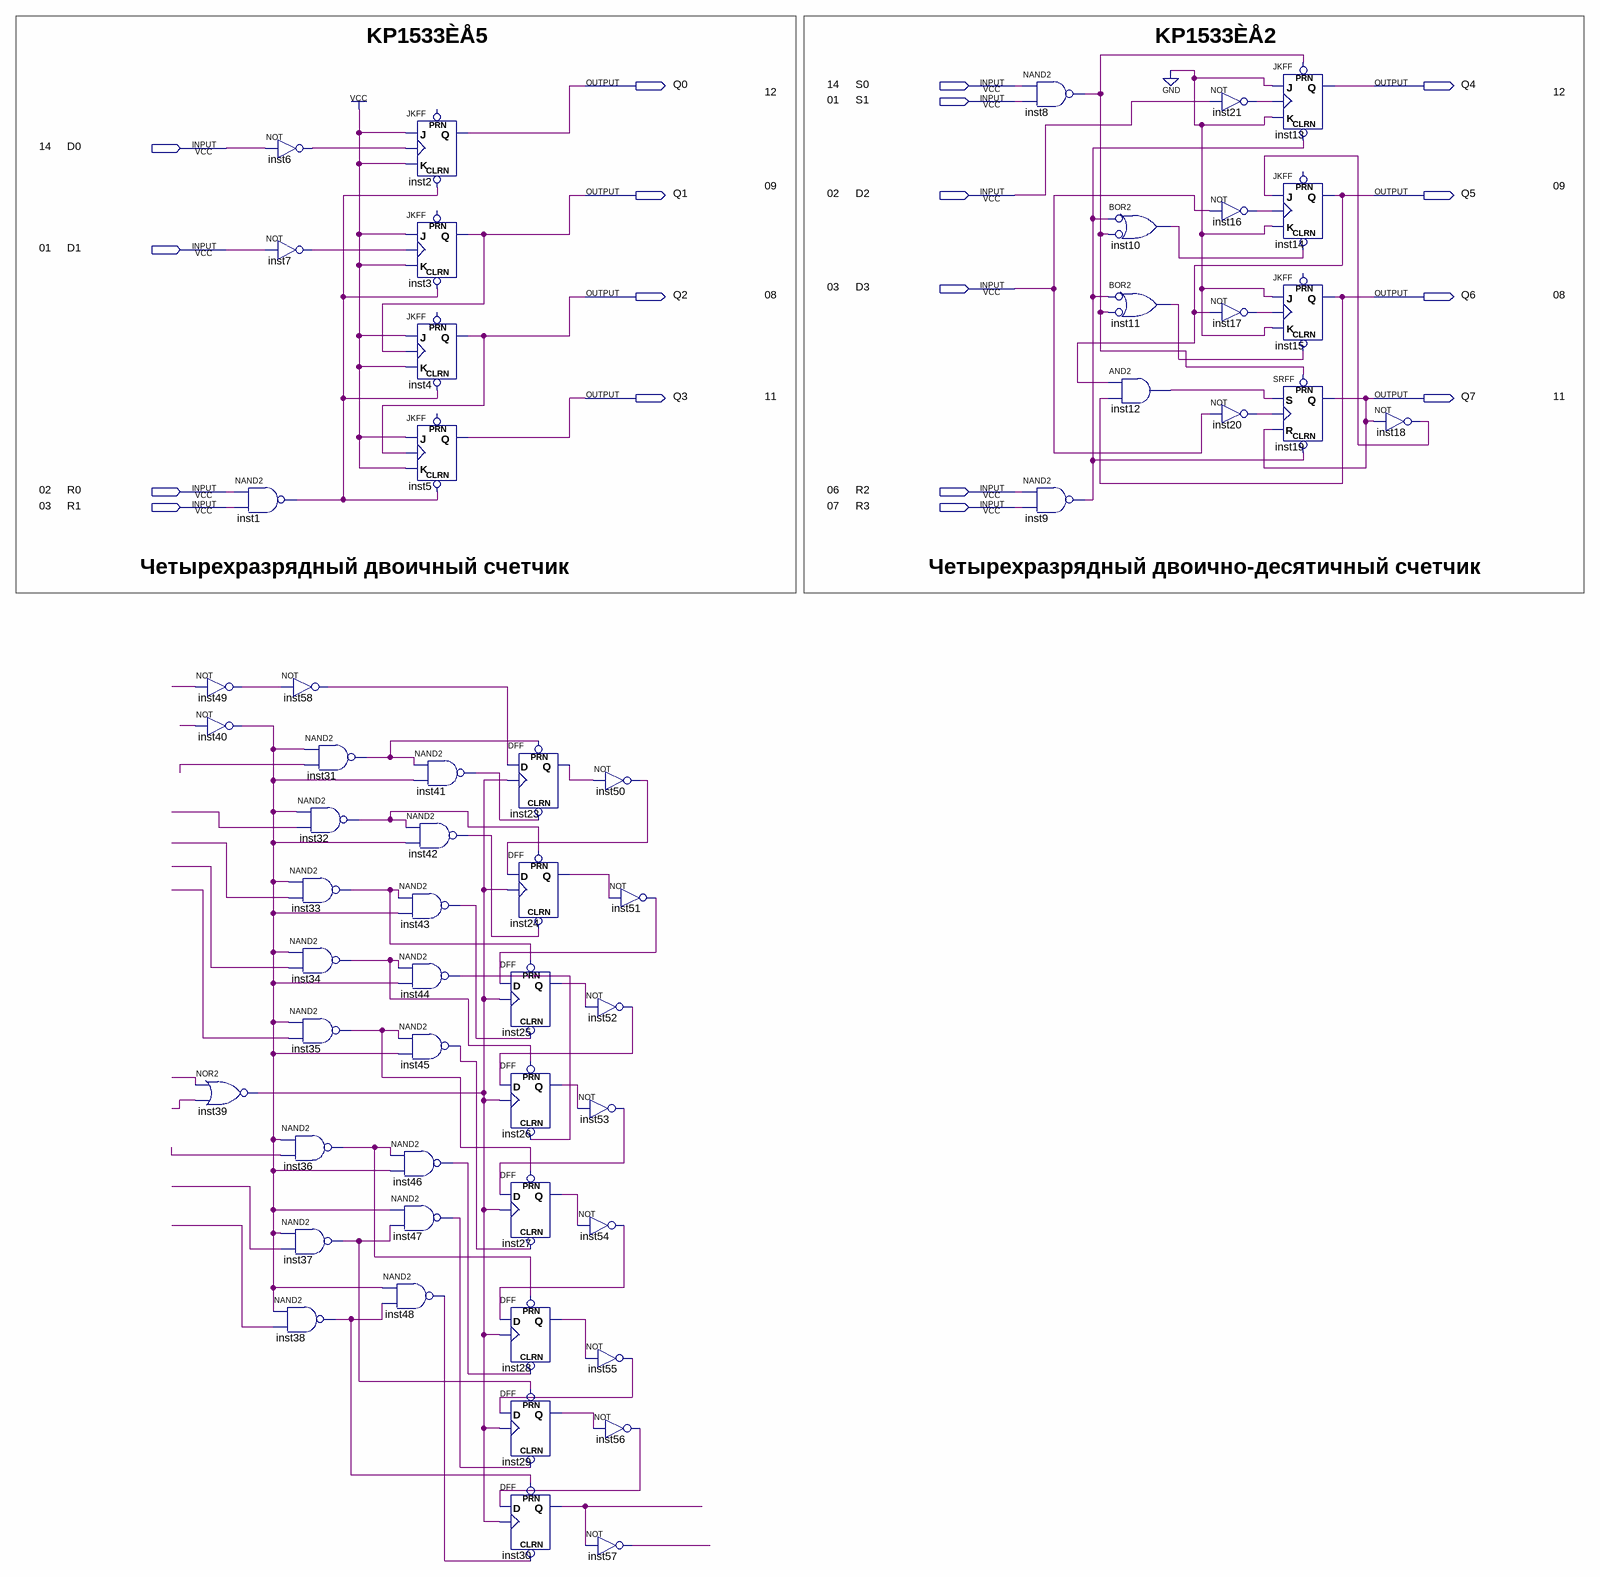
[diagram p0: schematic sheet]
// Quartus schematic tmp.bdf as structural Verilog: 57 symbols, 18 pins
module tmp (
  input  S0,
  input  S1,
  input  D0,
  input  D2,
  input  D1,
  input  D3,
  input  R0,
  input  R2,
  input  R1,
  input  R3,
  output Q0,
  output Q4,
  output Q1,
  output Q5,
  output Q2,
  output Q6,
  output Q3,
  output Q7
);

  wire inst1_out, inst6_out, inst7_out, inst8_out, inst9_out, inst10_out, inst11_out, inst12_out, inst16_out,
       inst17_out, inst18_out, inst20_out, inst21_out, inst23_q, inst24_q, inst25_q, inst26_q, inst27_q,
       inst28_q, inst29_q, inst30_q, inst31_out, inst32_out, inst33_out, inst34_out, inst35_out, inst36_out,
       inst37_out, inst38_out, inst39_out, inst40_out, inst41_out, inst42_out, inst43_out, inst44_out,
       inst45_out, inst46_out, inst47_out, inst48_out, inst49_out, inst50_out, inst51_out, inst52_out,
       inst53_out, inst54_out, inst55_out, inst56_out, inst57_out, inst58_out, undriven, undriven_2,
       undriven_3, undriven_4, undriven_5, undriven_6, undriven_7, undriven_8, undriven_9, undriven_10,
       undriven_11, undriven_12;

  not inst49 (inst49_out, undriven_12);
  not inst40 (inst40_out, undriven_3);
  nor inst39 (inst39_out, undriven, undriven_2);
  not inst6 (inst6_out, D0);
  not inst7 (inst7_out, D1);
  nand inst1 (inst1_out, R0, R1);
  not inst58 (inst58_out, inst49_out);
  nand inst33 (inst33_out, inst40_out, undriven_6);
  nand inst34 (inst34_out, inst40_out, undriven_7);
  nand inst35 (inst35_out, inst40_out, undriven_8);
  nand inst36 (inst36_out, inst40_out, undriven_9);
  nand inst37 (inst37_out, inst40_out, undriven_10);
  nand inst38 (inst38_out, inst40_out, undriven_11);
  nand inst31 (inst31_out, inst40_out, undriven_4);
  nand inst32 (inst32_out, inst40_out, undriven_5);
  JKFF inst2 (.CLRN(inst1_out), .K(1'b1), .J(1'b1), .CLK(inst6_out), .Q(Q0));  // open: PRN
  JKFF inst3 (.CLRN(inst1_out), .K(1'b1), .J(1'b1), .CLK(inst7_out), .Q(Q1));  // open: PRN
  JKFF inst4 (.CLRN(inst1_out), .K(1'b1), .J(1'b1), .CLK(Q1), .Q(Q2));  // open: PRN
  JKFF inst5 (.CLRN(inst1_out), .K(1'b1), .J(1'b1), .CLK(Q2), .Q(Q3));  // open: PRN
  nand inst41 (inst41_out, inst31_out, inst40_out);
  nand inst42 (inst42_out, inst32_out, inst40_out);
  nand inst43 (inst43_out, inst33_out, inst40_out);
  nand inst44 (inst44_out, inst34_out, inst40_out);
  nand inst45 (inst45_out, inst35_out, inst40_out);
  nand inst46 (inst46_out, inst36_out, inst40_out);
  nand inst47 (inst47_out, inst40_out, inst37_out);
  nand inst48 (inst48_out, inst40_out, inst38_out);
  DFF inst23 (.CLRN(inst41_out), .CLK(inst39_out), .D(inst58_out), .PRN(inst31_out), .Q(inst23_q));
  DFF inst24 (.CLRN(inst42_out), .CLK(inst39_out), .D(inst50_out), .PRN(inst32_out), .Q(inst24_q));
  DFF inst25 (.CLRN(inst43_out), .CLK(inst39_out), .D(inst51_out), .PRN(inst33_out), .Q(inst25_q));
  DFF inst26 (.CLRN(inst44_out), .CLK(inst39_out), .D(inst52_out), .PRN(inst34_out), .Q(inst26_q));
  DFF inst27 (.CLRN(inst45_out), .CLK(inst39_out), .D(inst53_out), .PRN(inst35_out), .Q(inst27_q));
  DFF inst28 (.CLRN(inst46_out), .CLK(inst39_out), .D(inst54_out), .PRN(inst36_out), .Q(inst28_q));
  DFF inst29 (.CLRN(inst47_out), .CLK(inst39_out), .D(inst55_out), .PRN(inst37_out), .Q(inst29_q));
  DFF inst30 (.CLRN(inst48_out), .CLK(inst39_out), .D(inst56_out), .PRN(inst38_out), .Q(inst30_q));
  not inst50 (inst50_out, inst23_q);
  not inst52 (inst52_out, inst25_q);
  not inst53 (inst53_out, inst26_q);
  not inst54 (inst54_out, inst27_q);
  not inst55 (inst55_out, inst28_q);
  not inst56 (inst56_out, inst29_q);
  not inst57 (inst57_out, inst30_q);
  not inst51 (inst51_out, inst24_q);
  nand inst8 (inst8_out, S0, S1);
  nand inst9 (inst9_out, R2, R3);
  or inst10 (inst10_out, ~inst9_out, ~inst8_out);  // BOR2
  or inst11 (inst11_out, ~inst9_out, ~inst8_out);  // BOR2
  and inst12 (inst12_out, Q5, Q6);
  not inst21 (inst21_out, D2);
  not inst16 (inst16_out, D3);
  not inst17 (inst17_out, Q5);
  not inst20 (inst20_out, D3);
  JKFF inst13 (.PRN(inst8_out), .CLRN(inst9_out), .K(1'b0), .J(1'b0), .CLK(inst21_out), .Q(Q4));
  JKFF inst14 (.CLRN(inst10_out), .K(1'b0), .J(inst18_out), .CLK(inst16_out), .Q(Q5));  // open: PRN
  JKFF inst15 (.CLRN(inst11_out), .K(1'b0), .J(1'b0), .CLK(inst17_out), .Q(Q6));  // open: PRN
  SRFF inst19 (.PRN(inst8_out), .CLRN(inst9_out), .S(inst12_out), .R(Q7), .CLK(inst20_out), .Q(Q7));
  not inst18 (inst18_out, Q7);

  // Notes on the sheet:
  //   KP1533ÈÅ5
  //   KP1533ÈÅ2
  //   14
  //   12
  //   12
  //   01
  //   14
  //   09
  //   09
  //   02
  //   01
  //   03
  //   08
  //   08
  //   11
  //   11
  //   02
  //   06
  //   03
  //   07
  //   Четырехразрядный двоичный счетчик
  //   Четырехразрядный двоично-десятичный счетчик
endmodule
